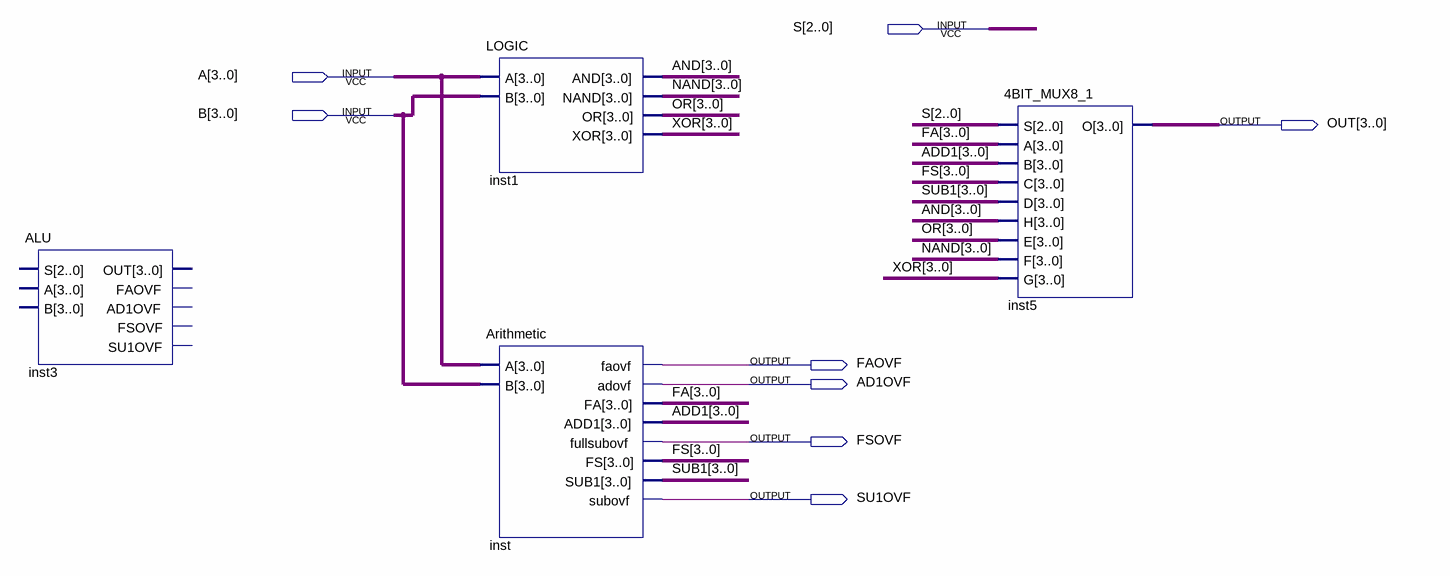
[diagram p0: schematic sheet]
// Quartus schematic Block3.bdf as structural Verilog: 4 symbols, 8 pins
module Block3 (
  input  [2:0] S,
  input  [3:0] A,
  input  [3:0] B,
  output [3:0] OUT,
  output FAOVF,
  output AD1OVF,
  output FSOVF,
  output SU1OVF
);

  wire [3:0] ADD1, AND, FA, FS, NAND, OR, SUB1, XOR;

  ALU inst3 ();  // open: S, A, B, OUT, FAOVF, AD1OVF, FSOVF, SU1OVF
  LOGIC inst1 (.A(A), .B(B), .AND(AND), .NAND(NAND), .OR(OR), .XOR(XOR));
  Arithmetic inst (
    .A(A), .B(B), .faovf(FAOVF), .adovf(AD1OVF), .FA(FA), .ADD1(ADD1), .fullsubovf(FSOVF), .FS(FS),
    .SUB1(SUB1), .subovf(SU1OVF));
  \4BIT_MUX8_1  inst5 (.S(S), .A(FA), .B(ADD1), .C(FS), .D(SUB1), .H(AND), .E(OR), .F(NAND), .G(XOR), .O(OUT));
endmodule
